# EasyEDA Pro project ZeptoWatch.eprj, board PCB3
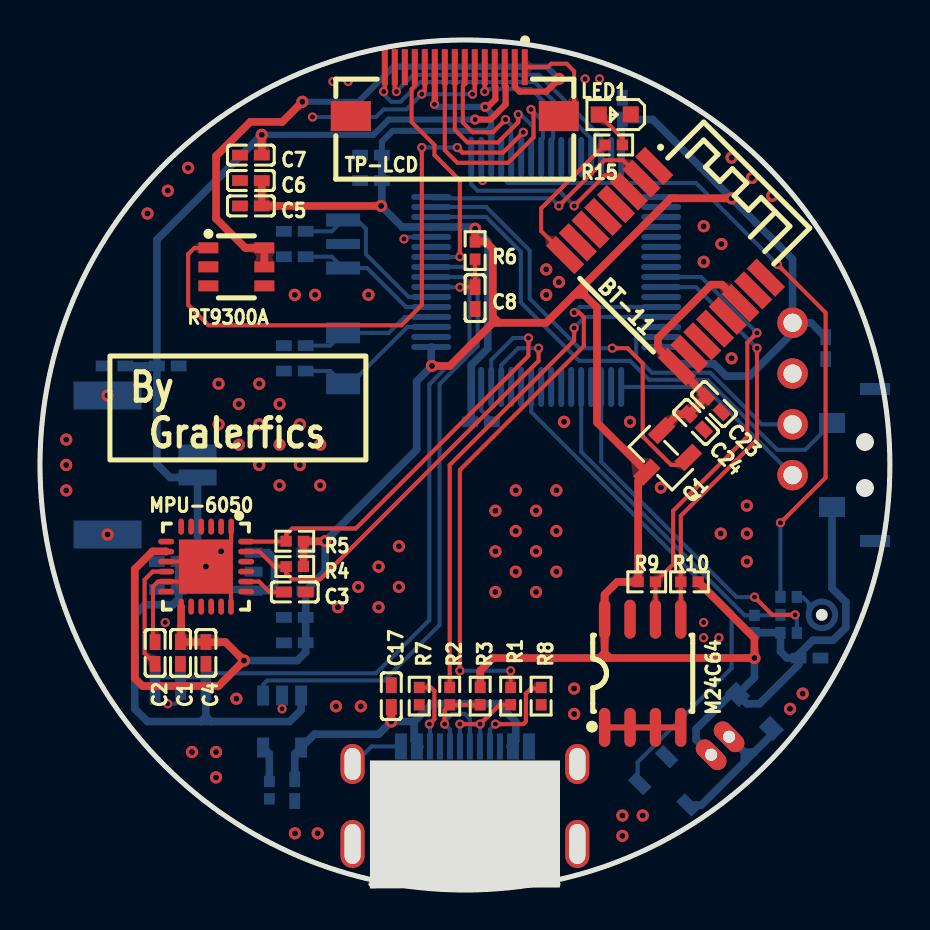
[diagram p10: board, top side]
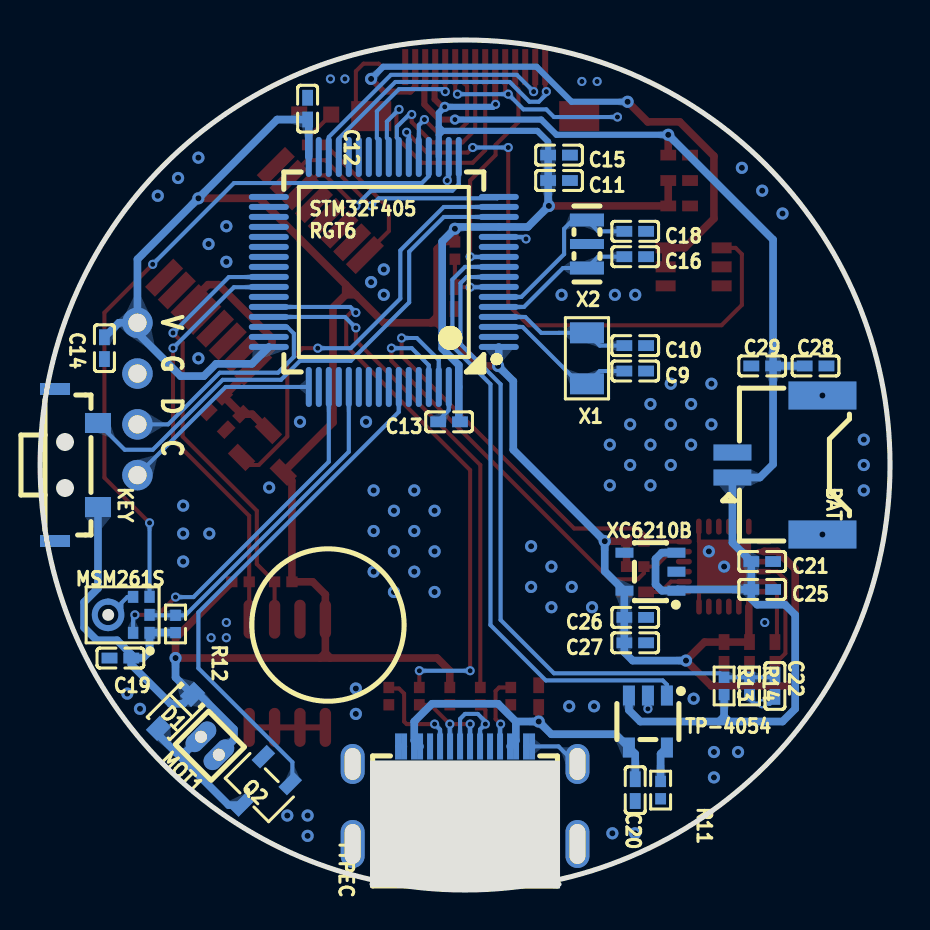
[diagram p11: board, bottom side, seen from below]

Outline 42.5 x 42.5 mm; copper layers: Top Layer, Bottom Layer. Coordinates in mm from the lower left corner of the outline.
Outline path: circle c21.25,21.25 r21.25
Stack: Top Layer 0.035mm / Dielectric1 1.51mm FR4 er 4.5 / Bottom Layer 0.035mm

## Design rules (mm)
spacing safeClearance (default): track to track 0.152, other pairs 0 to 0.152
track width trackWidth (default): min 0.127, default 0.254, max 2.54
differential pair differentialPair (default): width min 0.127, default 0.254, max 2.54; gap min 0.152, default 0.152
via viaSize (default): diameter min 0.381, default 0.457, max 10; hole min 0.203, default 0.254, max 5.999

## Placement (name value [footprint] x y rotation side)
BAT  1.25K-CB-2PWB  [CONN-SMD_2P-P1.25_L5.5-W7.7-2PWB]  5.63 21.25 90 bottom
BT-11  -  [BT-11]  33.19 38.39 315 top
C1  100nF  [C0402]  7.03 11.85 90 top
C2  100nF  [C0402]  5.76 11.85 90 top
C3  2.2nF  [C0402]  12.74 14.9 0 top
C4  100nF  [C0402]  8.3 11.85 90 top
C5  100nF  [C0402]  10.54 34.2 180 top
C6  100nF  [C0402]  10.54 35.47 180 top
C7  100nF  [C0402]  10.54 36.74 180 top
C8  100nF  [C0402]  21.76 29.59 90 top
C9  10pF  [C0402]  12.74 25.95 0 bottom
C10  10pF  [C0402]  12.74 27.22 0 bottom
C11  100nF  [C0402]  16.55 35.47 180 bottom
C12  100nF  [C0402]  29.12 39.07 90 bottom
C13  100nF  [C0402]  22.05 23.41 0 bottom
C14  100nF  [C0402]  39.28 27.09 270 bottom
C15  100nF  [C0402]  16.55 36.74 0 bottom
C16  20pF  [C0402]  12.74 31.66 0 bottom
C17  10uF  [C0402]  17.57 9.69 270 top
C18  20pF  [C0402]  12.74 32.93 0 bottom
C19  100nF  [C0402]  38.49 11.6 0 bottom
C20  100nF  [C0402]  12.74 4.99 270 bottom
C21  100nF  [C0402]  6.39 16.42 180 bottom
C22  100nF  [C0402]  5.76 10.2 270 bottom
C23  100nF  [C0402]  33.7 24.29 315 top
C24  10uF  [C0402]  32.81 23.4 135 top
C25  100nF  [C0402]  6.39 15.03 180 bottom
C26  100nF  [C0402]  12.74 13.63 180 bottom
C27  10uF  [C0402]  12.74 12.36 0 bottom
C28  10uF  [C0402]  3.72 26.2 0 bottom
C29  100nF  [C0402]  6.39 26.2 0 bottom
D1  B5819WS  [SOD-323_L1.8-W1.3-LS2.5-FD]  35.73 8.93 135 bottom
KEY  TS-KG012EV  [SW-SMD_TS-KG012EV]  40.68 21.25 270 bottom
LED1  D-060306B1  [LED0603-RD]  28.74 38.78 180 top
M24C64  M24C64-RMN6TP  [SOIC-8_L5.0-W4.0-P1.27-LS6.0-BL]  30.14 10.84 0 top
MOT1  LCM1027A2445F  [VIBRATING-MOTOR-SMD_WELDING]  34.01 7.21 225 bottom
MPU-6050  MPU-6050  [QFN-24_L4.0-W4.0-P0.50-BL-EP2.7]  8.31 16.17 180 top
MSM261S  MSM261S3526Z0CM  [MIC-SMD_6P-L3.5-W2.7-P0.90-TR]  38.4 13.76 270 bottom
NOREF  -  [Pad_e157]  37.63 25.82 45 top
NOREF#2  -  [Pad_e159]  37.63 20.74 45 top
NOREF#3  -  [Pad_e156]  37.63 28.36 45 top
NOREF#4  -  [Pad_e158]  37.63 23.28 45 top
Q1  AO3401  [SOT-23-3_L2.9-W1.3-P1.90-LS2.4-BR]  31.05 21.6 45 top
Q2  AO3400A  [SOT-23-3_L2.9-W1.6-P1.90-LS2.8-BR]  31.54 5.12 135 bottom
R1  22Ω  [R0402]  23.54 9.69 90 top
R2  22Ω  [R0402]  20.49 9.69 90 top
R3  1.5kΩ  [R0402]  22.01 9.69 270 top
R4  2.2kΩ  [R0402]  12.74 16.17 180 top
R5  2.2kΩ  [R0402]  12.74 17.44 180 top
R6  47kΩ  [R0402]  21.76 31.97 90 top
R7  5.1kΩ  [R0402]  18.96 9.69 90 top
R8  5.1kΩ  [R0402]  25.06 9.69 270 top
R9  10kΩ  [R0402]  30.34 15.41 0 top
R10  10kΩ  [R0402]  32.48 15.41 180 top
R11  1kΩ  [R0402]  11.47 4.99 270 bottom
R12  100kΩ  [R0402]  35.73 13.3 90 bottom
R13  20kΩ  [R0402]  8.3 10.2 90 bottom
R14  20kΩ  [R0402]  7.03 10.2 270 bottom
R15  1kΩ  [R0402]  28.69 37.25 180 top
RT9300A  -  [SOT-23-6_L2.9-W1.6-P0.95-LS2.8-BR]  9.82 31.16 180 top
STM32F405
RGT6  -  [LQFP-64_L10.0-W10.0-P0.50-LS12.0-BL]  25.31 30.9 90 bottom
TP-4054  TP4054-42-SOT25R  [SOT-23-5_L3.0-W1.7-P0.95-LS2.8-BR]  12.11 8.42 90 bottom
TP-LCD  KH-FG0.5-H2.0-15PIN  [FPC-SMD_15P-P0.50_KINGHELM_KH-FG0.5-H2.0-15PIN]  20.74 39.92 0 top
TYPEC  TYPE-C-16M-005  [USB-C-SMD_TYPE-C-16M-005]  21.25 4.74 180 bottom
X1  32.768kHz  [OSC-SMD_L3.2-W1.5]  15.15 26.58 270 bottom
X2  8MHz  [OSC-SMD_3P-L3.2-W1.3-P1.2-L]  15.15 32.3 90 bottom
XC6210B  XC6210B332MR  [SOT-25_L3.0-W1.6-P0.95-LS2.8-BL]  11.98 15.92 90 bottom

## Footprints (pads in the part's own frame, mm; a bottom-side part is the same pattern mirrored in y, then rotated)
BT-11
  rect 2x0.7 smd: 1(-0.2,-3.3) 2(-0.2,-4.2) 3(-0.2,-5.1) 4(-0.2,-6) 5(-0.2,-6.9) 6(-0.2,-7.8) 7(-0.2,-8.7) 8(-0.2,-9.6) 9(7.7,-9.6) 10(7.7,-8.7) 11(7.7,-7.8) 12(7.7,-6.9) 13(7.7,-6) 14(7.7,-5.1) 15(7.7,-4.2) 16(7.7,-3.3)
C0402
  rect 0.79x0.54 smd: 1(-0.545,0) 2(0.545,0)
CONN-SMD_2P-P1.25_L5.5-W7.7-2PWB
  rect 0.8x1.9 smd: 1(-0.625,2.25) 2(0.625,2.25)
  rect 1.4x3.4 smd: 3(3.475,-2.25) 4(-3.475,-2.25)
FPC-SMD_15P-P0.50_KINGHELM_KH-FG0.5-H2.0-15PIN
  rect 0.3x1.8 smd: 1(3.5,1.225) 2(3,1.225) 3(2.5,1.225) 4(2,1.225) 5(1.5,1.225) 6(1,1.225) 7(0.5,1.225) 8(0,1.225) 9(-0.5,1.225) 10(-1,1.225) 11(-1.5,1.225) 12(-2,1.225) 13(-2.499,1.225) 14(-3,1.225) 15(-3.499,1.225)
  rect 2x1.5 smd: 16(-5.2,-1.225) 17(5.2,-1.225)
LED0603-RD
  rect 0.8x0.8 smd: 1(-0.799,-0.004) 2(0.799,0.004)
LQFP-64_L10.0-W10.0-P0.50-LS12.0-BL
  oval 0.3x2 smd: 1(-3.75,-5.75) 2(-3.25,-5.75) 3(-2.75,-5.75) 4(-2.25,-5.75) 5(-1.75,-5.75) 6(-1.25,-5.75) 7(-0.75,-5.75) 8(-0.25,-5.75) 9(0.25,-5.75) 10(0.75,-5.75) 11(1.25,-5.75) 12(1.75,-5.75) 13(2.25,-5.75) 14(2.75,-5.75) 15(3.25,-5.75) 16(3.75,-5.75) 33(3.75,5.75) 34(3.25,5.75) 35(2.75,5.75) 36(2.25,5.75) 37(1.75,5.75) 38(1.25,5.75) 39(0.75,5.75) 40(0.25,5.75) 41(-0.25,5.75) 42(-0.75,5.75) 43(-1.25,5.75) 44(-1.75,5.75) 45(-2.25,5.75) 46(-2.75,5.75) 47(-3.25,5.75) 48(-3.75,5.75)
  oval 2x0.3 smd: 17(5.75,-3.75) 18(5.75,-3.25) 19(5.75,-2.75) 20(5.75,-2.25) 21(5.75,-1.75) 22(5.75,-1.25) 23(5.75,-0.75) 24(5.75,-0.25) 25(5.75,0.25) 26(5.75,0.75) 27(5.75,1.25) 28(5.75,1.75) 29(5.75,2.25) 30(5.75,2.75) 31(5.75,3.25) 32(5.75,3.75) 49(-5.75,3.75) 50(-5.75,3.25) 51(-5.75,2.75) 52(-5.75,2.25) 53(-5.75,1.75) 54(-5.75,1.25) 55(-5.75,0.75) 56(-5.75,0.25) 57(-5.75,-0.25) 58(-5.75,-0.75) 59(-5.75,-1.25) 60(-5.75,-1.75) 61(-5.75,-2.25) 62(-5.75,-2.75) 63(-5.75,-3.25) 64(-5.75,-3.75)
MIC-SMD_6P-L3.5-W2.7-P0.90-TR
  rect 0.6x0.52 smd: 1(0.9,1.367) 2(0.9,0.545) 4(-0.9,0.545) 5(-0.9,1.367) 6(0,1.367)
  custom 0x0 smd: 3(0,-1.367) 3(0,-0.042)
OSC-SMD_3P-L3.2-W1.3-P1.2-L
  rect 0.65x1.7 smd: 1(-1.199,0) 3(1.199,0)
  rect 0.5x1.7 smd: 2(0,0)
OSC-SMD_L3.2-W1.5
  rect 1.049x1.7 smd: 1(-1.275,0) 2(1.275,0)
Pad_e156
  round 1.524 hole 0.914: 2(0,0)
Pad_e157
  round 1.524 hole 0.914: 3(0,0)
Pad_e158
  round 1.524 hole 0.914: 4(0,0)
Pad_e159
  round 1.524 hole 0.914: 5(0,0)
QFN-24_L4.0-W4.0-P0.50-BL-EP2.7
  oval 0.28x0.8 smd: 1(-1.25,-2) 2(-0.75,-2) 3(-0.25,-2) 4(0.25,-2) 5(0.75,-2) 6(1.25,-2) 13(1.25,2) 14(0.75,2) 15(0.25,2) 16(-0.25,2) 17(-0.75,2) 18(-1.242,2)
  oval 0.8x0.28 smd: 7(2,-1.25) 8(2,-0.75) 9(2,-0.25) 10(2,0.25) 11(2,0.75) 12(2,1.25) 19(-2,1.25) 20(-2,0.75) 21(-2,0.25) 22(-2,-0.25) 23(-2,-0.75) 24(-2,-1.25)
  rect 2.7x2.7 smd: 25(0.013,0)
R0402
  rect 0.566x0.54 smd: 1(-0.433,0) 2(0.433,0)
SOD-323_L1.8-W1.3-LS2.5-FD
  rect 1x0.8 smd: 1(-1.2,0) 2(1.2,0)
SOIC-8_L5.0-W4.0-P1.27-LS6.0-BL
  oval 0.569x1.95 smd: 1(-1.905,-2.705) 2(-0.635,-2.705) 3(0.635,-2.705) 4(1.905,-2.705) 5(1.905,2.705) 6(0.635,2.705) 7(-0.635,2.705) 8(-1.905,2.705)
SOT-23-3_L2.9-W1.3-P1.90-LS2.4-BR
  rect 1.25x0.7 smd: 1(1,-0.95) 2(1,0.95) 3(-1,0)
SOT-23-3_L2.9-W1.6-P1.90-LS2.8-BR
  rect 1.07x0.6 smd: 1(1.235,-0.95) 2(1.235,0.95) 3(-1.235,0)
SOT-23-5_L3.0-W1.7-P0.95-LS2.8-BR
  rect 1x0.6 smd: 1(1.3,-0.95) 2(1.3,0) 3(1.3,0.95) 4(-1.3,0.95) 5(-1.3,-0.95)
SOT-23-6_L2.9-W1.6-P0.95-LS2.8-BR
  rect 1x0.55 smd: 1(1.4,-0.95) 2(1.4,0) 3(1.4,0.95) 4(-1.4,0.95) 5(-1.4,0) 6(-1.4,-0.95)
SOT-25_L3.0-W1.6-P0.95-LS2.8-BL
  rect 0.5x0.899 smd: 1(-0.95,-1.3) 2(0,-1.3) 3(0.95,-1.3) 4(0.95,1.3) 5(-0.95,1.3)
SW-SMD_TS-KG012EV
  rect 1.001x1.3 smd: 1(2.1,1.075) 2(-2.1,1.075)
  rect 0.6x1.501 smd: 3(-3.8,-1.075) 4(3.8,-1.075)
USB-C-SMD_TYPE-C-16M-005
  oval 1.199x1.999 hole 0.8x1.6: 17(5.621,1.562) 20(-5.621,1.562)
  oval 1.199x2.401 hole 0.8x1.999: 18(5.621,-2.438) 19(-5.621,-2.438)
  rect 0.299x1.3 smd: A1(-3.35,2.438) A4(-2.55,2.438) A5(-1.25,2.438) A6(-0.249,2.438) A7(0.249,2.438) A8(1.25,2.438) A9(2.55,2.438) A12(3.35,2.438) B1(3.05,2.438) B4(2.251,2.438) B5(1.75,2.438) B6(0.75,2.438) B7(-0.75,2.438) B8(-1.75,2.438) B9(-2.251,2.438) B12(-3.05,2.438)
VIBRATING-MOTOR-SMD_WELDING
  oval 0.9x1.8 hole 0.61: 1(-0.635,0) 2(0.635,0)

## Nets
GND: BAT.2 BAT.3 BAT.4 BT-11.1 BT-11.15 C1.1 C2.2 C3.2 C4.1 C5.2 C6.2 C7.2 C8.1 C9.1 C10.1 C11.2 C12.2 C13.2 C14.2 C15.1 C16.1 C17.1 C18.1 C19.2 C20.2 C21.2 C22.2 C23.2 C24.1 C25.2 C26.2 C27.1 C28.1 C29.2 KEY.3 KEY.4 LED1.1 M24C64.1 M24C64.2 M24C64.3 M24C64.4 M24C64.7 MPU-6050.1 MPU-6050.9 MPU-6050.11 MPU-6050.18 MPU-6050.25 MSM261S.3 MSM261S.4 NOREF.3 Q2.2 R7.1 R8.2 R11.2 R14.2 RT9300A.2 STM32F405
RGT6.12 STM32F405
RGT6.18 STM32F405
RGT6.63 TP-4054.2 TP-LCD.1 TP-LCD.6 TP-LCD.11 TP-LCD.16 TP-LCD.17 TYPEC.17 TYPEC.18 TYPEC.19 TYPEC.20 TYPEC.A1 TYPEC.A12 TYPEC.B1 TYPEC.B12 X2.2 XC6210B.2
VBAT: BAT.1 C7.1 C21.1 C25.1 C28.2 C29.1 R13.1 TP-4054.3 TP-LCD.3 XC6210B.1 XC6210B.3
VBUS: C17.2 C20.1 TP-4054.4 TYPEC.A4 TYPEC.A9 TYPEC.B4 TYPEC.B9
VCC_3V3: C1.2 C4.2 C5.1 C6.1 C11.1 C12.1 C13.1 C14.1 C15.2 C19.1 C26.1 C27.2 D1.2 KEY.1 M24C64.8 MOT1.2 MPU-6050.8 MPU-6050.13 MSM261S.1 NOREF#3.2 Q1.3 R3.1 R4.1 R5.1 R6.2 R9.1 R10.1 R12.1 STM32F405
RGT6.1 STM32F405
RGT6.13 STM32F405
RGT6.19 STM32F405
RGT6.32 STM32F405
RGT6.48 STM32F405
RGT6.64 TP-LCD.4 TP-LCD.10 XC6210B.5
VCC_BT: BT-11.9 BT-11.14 C23.1 C24.2 Q1.2
BAT_ADC: C22.1 R13.2 R14.1 STM32F405
RGT6.8
BAT_CHRG_R: STM32F405
RGT6.9 TP-4054.1
BT_ON_R: Q1.1 STM32F405
RGT6.15
I2S_CK: MSM261S.2 STM32F405
RGT6.51
I2S_SD: MSM261S.6 R12.2 STM32F405
RGT6.53
I2S_WS: MSM261S.5 STM32F405
RGT6.20
IMU_SCL: MPU-6050.23 R4.2 STM32F405
RGT6.61
IMU_SDA: MPU-6050.24 R5.2 STM32F405
RGT6.62
KEY_INT: KEY.2 STM32F405
RGT6.14
LCD_BLK: RT9300A.1 STM32F405
RGT6.22
LCD_DC: STM32F405
RGT6.25 TP-LCD.5
LCD_LEDK: RT9300A.5 RT9300A.6 TP-LCD.2
LCD_RST: STM32F405
RGT6.24 TP-LCD.9
LCD_SCL: STM32F405
RGT6.21 TP-LCD.7
LCD_SDA: STM32F405
RGT6.23 TP-LCD.8
MOTOR: Q2.1 STM32F405
RGT6.58
OLED_SCL: STM32F405
RGT6.56
OLED_SDA: STM32F405
RGT6.55
OSC32_IN: C9.2 STM32F405
RGT6.3 X1.2
OSC32_OUT: C10.2 STM32F405
RGT6.4 X1.1
OSC_IN: C16.2 STM32F405
RGT6.5 X2.1
OSC_OUT: C18.2 STM32F405
RGT6.6 X2.3
ROM_SCL: M24C64.6 R9.2 STM32F405
RGT6.41
ROM_SDA: M24C64.5 R10.2 STM32F405
RGT6.42
SWCLK: NOREF#2.5 STM32F405
RGT6.49
SWDIO: NOREF#4.4 STM32F405
RGT6.46
TP_RST: STM32F405
RGT6.10 TP-LCD.12
TP_SCL: STM32F405
RGT6.29 TP-LCD.15
TP_SDA: STM32F405
RGT6.30 TP-LCD.14
UART_RX: BT-11.3 STM32F405
RGT6.17
UART_TX: BT-11.2 STM32F405
RGT6.16
USB_DN: R1.2 STM32F405
RGT6.44
USB_DN_IN: R1.1 TYPEC.A7 TYPEC.B7
USB_DP: R2.2 STM32F405
RGT6.45
USB_DP_IN: R2.1 R3.2 TYPEC.A6 TYPEC.B6
$1N4163: C2.1 MPU-6050.10
$1N4165: C3.1 MPU-6050.20
$1N4191: C8.2 R6.1 STM32F405
RGT6.7
$1N4208: R7.2 TYPEC.B5
$1N4211: R8.1 TYPEC.A5
$1N92743: BT-11.8 R15.2
$1N93624: LED1.2 R15.1
$1N104069: D1.1 MOT1.1 Q2.3
$1N121928: R11.1 TP-4054.5

Pads without a net: BT-11 4 5 6 7 10 11 12 13 16; MPU-6050 2 3 4 5 6 7 12 14 15 16 17 19 21 22; RT9300A 3 4; STM32F405
RGT6 2 11 26 27 28 31 33 34 35 36 37 38 39 40 43 47 50 52 54 57 59 60; TP-LCD 13; TYPEC A8 B8; XC6210B 4

## Via types
v1: diameter 0.61, hole 0.305, Top Layer to Bottom Layer, 88 vias
v2: diameter 0.457, hole 0.254, Top Layer to Bottom Layer, 47 vias
v3: diameter 0.508, hole 0.254, Top Layer to Bottom Layer, 2 vias

## Routing (per net, layer and track width the routed paths; a pad name or vN(x,y) marks a point on that pad's centre or on a via; arc(x,y) is an arc through that point)
GND: length 44.1
  Top Layer w0.203: TP-LCD.1 25.4,41.14 25.57,41.32 26.33,41.32 26.71,40.94 26.71,39.03 26.38,38.69 TP-LCD.17 ; MPU-6050.1 9.56,17.43 v1(9.06,16.93) ; TP-LCD.6 21.74,39.9 v2(21.63,39.79) ; MPU-6050.18 9.55,14.92 v1(8.3,16.17) ; C2.2 5.65,12.5 5.65,15.18 5.9,15.42 MPU-6050.11 7.55,15.42 v1(8.3,16.17) ; v2(19.09,39.79) 19.24,39.94 TP-LCD.11 ; v1(8.3,16.17) 8.05,16.42 MPU-6050.9
  Top Layer w0.305: M24C64.4 M24C64.3 M24C64.2 M24C64.1
  Bottom Layer w0.203: C22.2 5.76,9.57 6.01,9.31 v2(6.39,9.31) 6.77,9.31 7.03,9.57 R14.2 ; TYPEC.17 15.7,6.3 16.58,7.18 TYPEC.A12 ; C13.2 22.59,23.46 22.06,23.99 STM32F405
RGT6.63 ; v2(21.63,39.79) v2(19.09,39.79) 18.33,39.03 17.19,39.03 16.81,38.65 v2(13.63,38.65) ; STM32F405
RGT6.18 22.06,35.55 v2(22.14,35.47) ; MSM261S.4 37.86,14.65 38.14,14.65 38.44,14.35 MSM261S.3 ; v2(12.11,9.06) TP-4054.2 ; STM32F405
RGT6.12 18.3,32.65 v2(18.2,32.55)
  Bottom Layer w0.305: TYPEC.B1 TYPEC.A12 ; TYPEC.A1 TYPEC.B12
  vias: v1(1.31,22.52) v1(1.31,21.25) v1(1.31,19.98) v1(3.38,24.72) v1(3.38,17.78) v1(5.38,33.82) v1(6.39,34.97) v1(7.41,36.11) v1(7.6,6.9) v1(8.8,6.9) v1(8.8,5.63) v1(8.93,25.31) v1(8.93,23.28) v1(9.82,9.57) v1(9.95,24.3) v1(9.95,22.27) v1(10.96,25.31) v1(10.96,23.28) v1(10.96,21.25) v1(11.98,24.3) v1(11.98,22.27) v1(11.98,20.23) v1(12.74,29.76) v1(12.75,2.84) v1(13,23.28) v1(13,21.25) v1(13.76,29.76) v1(13.88,2.84) v1(14.01,22.27) v1(14.01,20.23) v1(14.8,9.19) v1(14.9,14.14) v1(15.92,15.15) v1(16.04,9.19) v1(16.42,29.76) v1(16.93,16.17) v1(16.93,14.14) v1(17.95,17.19) v1(17.95,15.15) v1(22.77,18.96) v1(22.77,16.93) v1(22.77,14.9) v1(23.79,19.98) v1(23.79,17.95) v1(23.79,15.92) v1(24.81,18.96) v1(24.81,16.93) v1(24.81,14.9) v1(25.31,31.03) v1(25.31,29.76) v1(25.82,19.98) v1(25.82,17.95) v1(25.82,15.92) v1(25.95,30.39) v1(26.2,23.41) v1(26.71,10.07) v1(26.71,8.8) v1(29.12,3.72) v1(29.12,2.71) v1(29.5,23.41) v1(30.14,3.72) v1(31.05,20.12) v1(33.19,33.19) v1(33.19,31.41) v1(34.08,32.3) v1(34.04,17.82) v1(34.59,36.62) v1(34.59,26.58) v1(35.35,19.22) v1(35.35,17.82) v1(35.35,16.42) v1(35.6,35.6) v1(36.62,34.71) v1(37.51,9.06) v1(38.14,9.82) v2(6.26,13.38) v2(14.65,40.43) v2(15.41,40.43) v2(27.26,40.55) v2(27.98,40.55) v2(33.19,13.38) v2(33.19,12.61) v2(33.95,12.61)
VBAT: length 70.7
  Top Layer w0.305: TP-LCD.3 23.24,40.21 23.28,40.17 23.28,39.28 22.53,38.52 v3(21.76,38.52)
  Top Layer w0.381: v1(11.09,37.76) C7.1
  Bottom Layer w0.305: v1(11.09,37.76) 16.68,37.76 17.44,38.52 v3(21.76,38.52)
  Bottom Layer w0.381: 8.04,8.42 5.38,8.42 4.74,9.06 4.74,13.76 5.25,14.27 6.65,14.27 6.94,14.56 C25.1 ; 8.04,8.42 8.3,8.68 ; 8.04,8.42 8.55,8.42 ; R13.1 8.3,8.68 ; 8.3,8.68 8.55,8.42 ; C25.1 10.62,15.03 XC6210B.1 11.41,14.97 11.72,15.28 11.72,16.55 11.41,16.87 XC6210B.3 ; C25.1 C21.1 7.88,17.37 BAT.1 6.51,20.62 5.85,21.29 C29.1 ; 8.55,8.42 12.49,8.42 13.06,8.99 TP-4054.3 ; v1(11.09,37.76) 5.85,32.52 C29.1 ; C29.1 4.27,26.2
VBUS: length 17.2
  Top Layer w0.381: C17.2 v1(17.57,8.42)
  Bottom Layer w0.381: TYPEC.B4 18.71,7.47 18.71,8.42 ; 18.71,8.42 v1(17.57,8.42) 16.93,7.79 13.72,7.79 TP-4054.4 12.74,6.81 C20.1 ; 18.71,8.42 19.6,9.31 22.9,9.31 23.79,8.42 23.79,7.47 TYPEC.B9
VCC_3V3: length 200.9
  Top Layer w0.305: v3(22.27,39.16) 22.39,39.16 22.77,39.54 22.77,40.17 22.74,40.2 TP-LCD.4 ; v2(19.73,39.28) 19.74,39.3 TP-LCD.10
  Top Layer w0.381: MPU-6050.13 7.06,12.43 C1.2 C4.2 9.28,12.4 v1(10.2,11.47) 8.93,10.2 5.12,10.2 4.74,10.58 4.74,16.04 5.63,16.93 6.3,16.93 MPU-6050.8 ; R3.1 22.01,10.96 22.65,11.6 27.98,11.6 ; 27.22,29.76 26.71,29.76 ; 27.22,29.76 27.85,29.12 27.85,23.37 Q1.3 29.91,20.46 R9.1 28.87,15.41 28.24,14.77 M24C64.8 28.24,11.85 ; 27.22,29.76 27.22,30.27 ; 26.71,29.76 27.22,30.27 ; 26.71,29.76 25.31,28.36 22.96,28.36 ; 28.49,11.6 v1(35.73,11.6) 35.73,12.59 R10.1 ; 28.49,11.6 27.98,11.6 ; 28.49,11.6 28.24,11.85 ; 27.98,11.6 28.24,11.85 ; v1(19.6,26.2) 20.49,26.2 22.65,28.36 ; 22.65,28.67 22.65,32.05 22.27,32.43 21.78,32.43 R6.2 v1(21.76,33.06) ; 22.65,28.67 22.96,28.36 ; 22.65,28.67 22.65,28.36 ; v1(34.59,34.58) 31.54,34.58 27.22,30.27 ; 22.96,28.36 22.65,28.36 ; R4.1 R5.1 v1(14.26,17.44) ; v1(17.06,34.2) C5.1 C6.1
  Bottom Layer w0.305: 22.56,37.75 STM32F405
RGT6.19 ; 22.56,37.75 22.56,38.16 ; 22.56,37.75 22.36,37.96 ; v2(19.73,39.28) 19.85,39.16 v3(22.27,39.16) 22.56,38.86 22.56,38.16 ; 22.56,38.16 22.36,37.96 ; C15.2 17.1,37.42 17.64,37.96 22.36,37.96
  Bottom Layer w0.381: D1.2 35.73,10.63 v1(35.73,11.6) ; D1.2 35.35,9.31 35.98,9.31 37.94,11.27 C19.1 ; D1.2 34.54,9.78 32.81,8.04 32.81,7.52 MOT1.2 ; 13.29,14.96 14.26,15.94 v1(14.26,17.44) 18.84,22.01 18.84,25.44 v1(19.6,26.2) 19.56,26.24 STM32F405
RGT6.1 ; 13.29,14.96 XC6210B.5 ; 13.29,14.96 C26.1 C27.2 13.29,11.89 12.87,11.47 v1(10.2,11.47) ; NOREF#3.2 38.56,28.36 C14.1 ; NOREF#3.2 37.63,31.54 v1(34.59,34.58) 30.65,38.52 C12.1 29.06,38.46 STM32F405
RGT6.32 ; NOREF#3.2 37.63,27.85 35.47,25.69 34.31,25.69 33.7,26.31 31.91,26.31 STM32F405
RGT6.48 ; C13.1 21.56,23.47 STM32F405
RGT6.64 21.56,26.25 22.39,27.08 22.39,32.43 v1(21.76,33.06) 21.67,33.15 STM32F405
RGT6.13 18.11,33.15 v1(17.06,34.2) 17.1,34.24 C11.1 C15.2 ; R12.1 37.02,12.87 MSM261S.1 37.03,11.93 37.36,11.6 C19.1 ; C19.1 37.94,11.78 38.65,12.49 39.66,12.49 40.3,13.12 40.3,14.39 39.61,15.09 KEY.1
VCC_BT: length 12.5
  Top Layer w0.381: Q1.2 31.9,23.79 C24.2 33.31,24.68 33.31,24.69 BT-11.9 31.83,26.16 30.9,27.09 30.9,27.6 33.57,30.27 34.1,30.27 BT-11.14
BAT_ADC: length 34.7
  Bottom Layer w0.203: C22.1 5.87,10.63 R14.1 R13.2 8.5,10.84 16.81,10.84 19.47,13.5 19.47,25.29 21.48,27.29 21.48,30.34 21.17,30.65 19.57,30.65 STM32F405
RGT6.8
BAT_CHRG_R: length 31.2
  Bottom Layer w0.203: STM32F405
RGT6.9 19.57,31.16 21.25,31.16 21.88,30.52 21.88,27.2 19.98,25.29 19.98,13.25 17.21,10.48 11.37,10.48 11.16,10.27 TP-4054.1
BT_ON_R: length 21.9
  Top Layer w0.203: Q1.1 32.04,21.25 31.56,21.25 30.14,22.67 30.14,26.33 29.38,27.09 v2(28.62,27.09)
  Bottom Layer w0.203: v2(28.62,27.09) 26.97,27.09 24.49,29.57 24.49,31.98 22.31,34.15 STM32F405
RGT6.15
I2S_CK: length 17.5
  Top Layer w0.203: v2(37.76,13.76) 36.62,13.76 v2(35.73,14.65)
  Bottom Layer w0.203: STM32F405
RGT6.51 28.06,21.41 34.83,14.65 v2(35.73,14.65) ; v2(37.76,13.76) 37.85,13.67 MSM261S.2
I2S_SD: length 16.6
  Bottom Layer w0.203: STM32F405
RGT6.53 27.06,21.91 35.24,13.73 R12.2 37,13.73 MSM261S.6
I2S_WS: length 35.2
  Top Layer w0.203: v2(36.87,31.28) 39.28,28.87 39.28,20.61 v2(37.03,18.36)
  Bottom Layer w0.203: STM32F405
RGT6.20 23.06,35.69 23.41,35.35 32.81,35.35 v2(36.87,31.28) ; v2(37.03,18.36) MSM261S.5
IMU_SCL: length 23.9
  Top Layer w0.203: MPU-6050.23 10.97,16.92 11.72,16.17 R4.2 12.31,15.84 12.61,15.53 14.01,15.53 24.93,26.46 v2(24.93,27.09)
  Bottom Layer w0.203: v2(24.93,27.09) 23.92,27.09 23.06,26.24 STM32F405
RGT6.61
IMU_SDA: length 22.7
  Top Layer w0.203: MPU-6050.24 12.29,17.42 R5.2 12.31,17.77 12.61,18.08 15.79,18.08 24.43,26.71 v2(24.43,27.6)
  Bottom Layer w0.203: v2(24.43,27.6) 23.66,27.6 22.56,26.5 STM32F405
RGT6.62
KEY_INT: length 26.9
  Bottom Layer w0.203: STM32F405
RGT6.14 22.31,33.65 24.04,31.92 24.04,29.38 26.97,26.46 29.5,26.46 30.45,25.51 33.37,25.51 36.87,22.01 38.27,22.01 KEY.2
LCD_BLK: length 31
  Top Layer w0.203: v2(19.09,37.12) 19.09,29.25 18.07,28.23 8.42,28.23 7.41,29.25 7.41,31.79 7.72,32.11 RT9300A.1 ; v2(20.87,37.12) 21.12,36.87 23.16,36.87 v2(24.17,37.89)
  Bottom Layer w0.203: v2(24.17,37.89) 24.06,37.78 STM32F405
RGT6.22 ; v2(20.87,37.12) v2(19.09,37.12)
LCD_DC: length 7.5
  Top Layer w0.203: 22.24,39.92 TP-LCD.5
  Bottom Layer w0.203: STM32F405
RGT6.25 25.56,37.5 25.66,37.6 25.66,38.94 24.55,40.05 22.37,40.05 v2(22.24,39.92)
LCD_LEDK: length 29.9
  Top Layer w0.305: v1(25.95,40.55) 25.31,39.92 23.99,39.92 23.74,40.16 TP-LCD.2
  Top Layer w0.381: RT9300A.5 RT9300A.6 10.27,32.11 8.8,33.57 8.8,36.7 10.51,38.41 12.12,38.41 v1(13.12,39.41)
  Bottom Layer w0.305: v1(25.95,40.55) 25.34,41.16 17.68,41.16 15.92,39.41 v1(13.12,39.41)
LCD_RST: length 13.5
  Top Layer w0.203: TP-LCD.9 20.24,36.99 20.87,36.36 23.41,36.36 24.68,37.63 24.68,38.9 v2(24.55,39.03)
  Bottom Layer w0.203: STM32F405
RGT6.24 25.06,37.51 25.16,37.61 25.16,38.42 v2(24.55,39.03)
LCD_SCL: length 7.4
  Top Layer w0.203: TP-LCD.7 21.24,40.29 21.15,40.2 21.15,38.37 21.63,37.89 22.65,37.89 v2(23.28,38.52)
  Bottom Layer w0.203: v2(23.28,38.52) 23.56,38.24 23.56,37.61 23.56,37.61 STM32F405
RGT6.21
LCD_SDA: length 9.9
  Top Layer w0.203: v2(23.92,38.78) 23.92,38.39 22.9,37.38 21.38,37.38 20.74,38.01 TP-LCD.8
  Bottom Layer w0.203: STM32F405
RGT6.23 24.56,37.52 24.66,37.61 24.66,38.16 24.04,38.78 v2(23.92,38.78)
MOTOR: length 26
  Bottom Layer w0.203: STM32F405
RGT6.58 24.56,23.91 34.59,13.88 34.59,11.09 29.89,6.39 29.89,5.43 Q2.1
OSC32_IN: length 7.7
  Bottom Layer w0.203: STM32F405
RGT6.3 18.37,28.15 15.53,25.31 X1.2 14.51,25.95 C9.2
OSC32_OUT: length 6.9
  Bottom Layer w0.203: STM32F405
RGT6.4 18.24,28.65 17.44,27.85 16.56,27.85 16.55,27.86 15.15,27.86 14.51,27.22 C10.2
OSC_IN: length 7.3
  Bottom Layer w0.203: STM32F405
RGT6.5 18.3,29.15 16.35,31.1 X2.1 14.59,31.66 C16.2
OSC_OUT: length 8.8
  Bottom Layer w0.203: C18.2 14.59,32.93 X2.3 15.86,33.5 16.3,33.06 16.3,31.79 18.44,29.65 STM32F405
RGT6.6
ROM_SCL: length 22.4
  Top Layer w0.203: M24C64.6 R9.2 31.66,16.3 31.66,18.96 35.37,22.67 35.37,27.37 v2(35.85,27.85)
  Bottom Layer w0.203: v2(35.85,27.85) 33.06,30.65 31.07,30.65 STM32F405
RGT6.41
ROM_SDA: length 21.2
  Top Layer w0.203: M24C64.5 R10.2 32.04,18.71 35.85,22.52 v2(35.85,27.09)
  Bottom Layer w0.203: v2(35.85,27.09) 32.81,30.14 31.08,30.14 STM32F405
RGT6.42
SWCLK: length 10.4
  Bottom Layer w0.203: STM32F405
RGT6.49 33.22,25.15 NOREF#2.5
SWDIO: length 11.8
  Bottom Layer w0.203: STM32F405
RGT6.46 30.14,28.15 29.81,27.82 29.81,26.66 30.6,25.86 33.52,25.86 36.1,23.28 NOREF#4.4
TP_RST: length 12
  Top Layer w0.203: TP-LCD.12 18.74,40.2 18.58,40.05 18.58,38.39 19.73,37.25 19.73,36.74 21,35.47 v2(21,31.66)
  Bottom Layer w0.203: v2(21,31.66) 20.98,31.65 STM32F405
RGT6.10
TP_SCL: length 14.4
  Top Layer w0.203: TP-LCD.15 17.24,39.98 v2(17.19,39.92)
  Bottom Layer w0.203: v2(17.19,39.92) 17.19,39.79 17.57,39.41 18.03,39.41 19.02,40.4 24.74,40.4 27.56,37.57 STM32F405
RGT6.29
TP_SDA: length 14.1
  Top Layer w0.203: v2(17.82,39.92) 17.74,40 TP-LCD.14
  Bottom Layer w0.203: v2(17.82,39.92) 18.66,40.76 24.96,40.76 28.06,37.65 STM32F405
RGT6.30
UART_RX: length 10.7
  Top Layer w0.203: v2(26.71,34.2) 28.24,35.73 28.64,35.73 BT-11.3
  Bottom Layer w0.203: STM32F405
RGT6.17 21.56,35.29 21.88,34.97 25.95,34.97 v2(26.71,34.2)
UART_TX: length 12
  Top Layer w0.203: v2(25.95,34.2) 28.24,36.49 29.15,36.49 BT-11.2
  Bottom Layer w0.203: v2(25.95,34.2) 25.57,34.58 19.63,34.58 STM32F405
RGT6.16
USB_DN: length 28.7
  Top Layer w0.203: v2(23.54,10.96) R1.2 ; v2(26.71,28.87) 26.97,28.87 27.19,28.64 27.19,27.19 21,21 v2(21,10.96)
  Bottom Layer w0.203: STM32F405
RGT6.44 26.99,29.15 v2(26.71,28.87) ; v2(21,10.96) v2(23.54,10.96)
USB_DN_IN: length 5.2
  Top Layer w0.203: R1.1 22.98,9.26 v2(22.01,8.3) v2(21,8.3)
  Bottom Layer w0.203: v2(22.01,8.3) 22.01,7.19 TYPEC.B7 ; v2(21,8.3) 21,8.29 TYPEC.A7
USB_DP: length 25.1
  Top Layer w0.203: R2.2 20.49,21.25 26.71,27.47 v2(26.71,28.11)
  Bottom Layer w0.203: v2(26.71,28.11) 27.25,28.65 STM32F405
RGT6.45
USB_DP_IN: length 6.9
  Top Layer w0.203: R3.2 R2.1 20.23,9.01 v2(20.23,8.3)
  Bottom Layer w0.203: TYPEC.B6 20.5,8.03 v2(20.23,8.3) 20.23,8.42 20.62,8.8 21.25,8.8 21.5,8.56 TYPEC.A6
$1N4163: length 5.7
  Top Layer w0.203: MPU-6050.10 5.63,15.92 5.23,15.52 5.23,11.83 C2.1
$1N4165: length 2.1
  Top Layer w0.203: C3.1 11.47,14.9 10.95,15.42 MPU-6050.20
$1N4191: length 3.6
  Top Layer w0.203: 21.76,31.54 C8.2 v2(21,30.14)
  Bottom Layer w0.203: v2(21,30.14) 19.58,30.14 STM32F405
RGT6.7
$1N4208: length 3.7
  Top Layer w0.203: v2(19.47,8.3) 19.73,8.55 19.73,9.95 19.55,10.13 R7.2
  Bottom Layer w0.203: TYPEC.B5 19.5,8.27 v2(19.47,8.3)
$1N4211: length 5.1
  Top Layer w0.203: v2(22.77,8.3) 24.17,8.3 24.3,8.42 24.3,9.82 24.55,10.07 25.01,10.07 R8.1
  Bottom Layer w0.203: v2(22.77,8.3) 22.5,8.02 TYPEC.A5
$1N92743: length 7.3
  Top Layer w0.203: R15.2 28.24,37.25 25.06,34.08 25.06,32.95 BT-11.8
$1N93624: length 2
  Top Layer w0.203: LED1.2 29.12,37.59 R15.1
$1N104069: length 8
  Bottom Layer w0.381: 35.22,6.39 33.08,4.25 Q2.3 ; 35.22,6.39 35.73,6.9 ; 35.22,6.39 35.22,6.9 ; 35.73,6.9 36.58,7.75 D1.1 ; 35.73,6.9 35.22,6.9 ; 35.22,6.9 MOT1.1
$1N121928: length 1.8
  Bottom Layer w0.381: R11.1 11.47,6.81 TP-4054.5

## Copper pours and planes (outline as drawn; the poured copper is in the pictures)
GND on Top Layer: -0.34,42.84 42.84,42.84 42.84,-0.34 -0.34,-0.34
GND on Bottom Layer: -0.34,42.84 42.84,42.84 42.84,-0.34 -0.34,-0.34

Small or netless copper shapes (teardrops, artwork), in the pictures only: 138 on Top Layer, 184 on Bottom Layer

## Text on the board
Bottom Silkscreen Layer: V  G  D  C
Top Silkscreen Layer: By / Gralerfics
